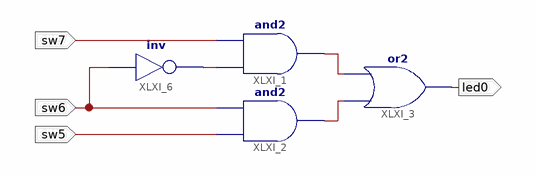
[diagram p0: schematic sheet 1]
// Xilinx ISE schematic CE1_Orner_Top.sch (spartan3e) as structural Verilog: 4 symbols, 4 ports
module CE1_Orner_Top (
  input  sw7,
  input  sw5,
  input  sw6,
  output led0
);

  wire XLXN_3, XLXN_4, XLXN_30;

  and XLXI_1 (XLXN_3, XLXN_30, sw7);
  and XLXI_2 (XLXN_4, sw5, sw6);
  or XLXI_3 (led0, XLXN_4, XLXN_3);
  not XLXI_6 (XLXN_30, sw6);
endmodule
